# EAGLE schematic GatewayLoRa (EAGLE 9.6.2)

## Sheet 1 of 2
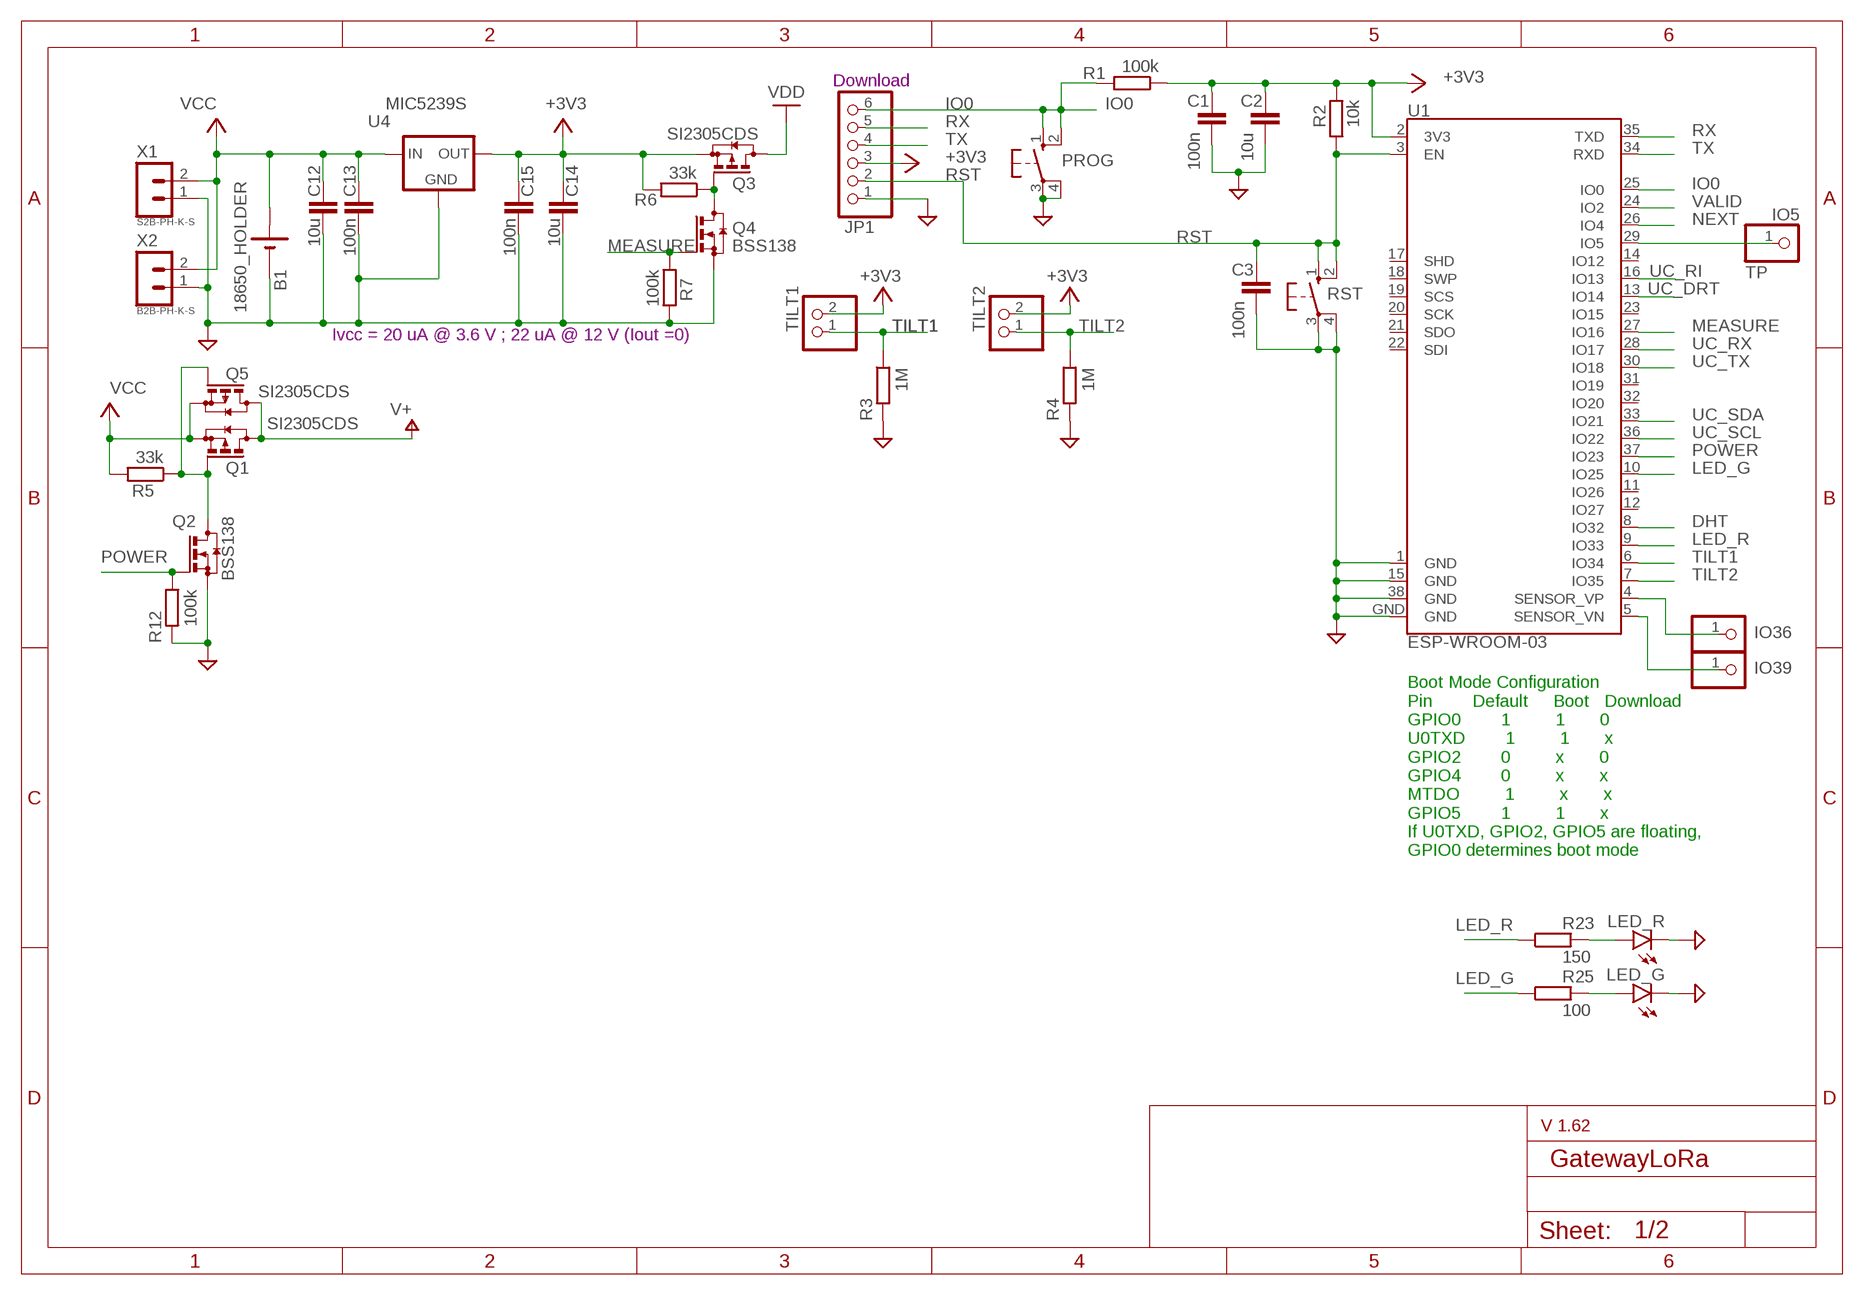
[diagram p0: schematic, sheet 1]

### Parts
B1  18650_HOLDER  [18650]
C1  100n  CC1206  [C1206]
C2  10u  CC1210  [C1210]
C3  100n  CC1206  [C1206]
C12  10u  CC1210  [C1210]
C13  100n  CC1206  [C1206]
C14  10u  CC1210  [C1210]
C15  100n  CC1206  [C1206]
IO5  TP  PINHD-1X1  [1X01]
IO36  PINHD-1X1  [1X01]
IO39  PINHD-1X1  [1X01]
JP1  PINHD-1X6  [1X06]
LED_G  LEDSMT1206  [1206]
LED_R  LEDSMT1206  [1206]
PROG  10-XX  [B3F-10XX]
Q1  SI2305CDS  [SOT23]
Q2  BSS138  BSS131  [SOT23]
Q3  SI2305CDS  [SOT23]
Q4  BSS138  BSS131  [SOT23]
Q5  SI2305CDS  [SOT23]
R1  100k  RR1206  [R1206]
R2  10k  RR1206  [R1206]
R3  1M  RR1206  [R1206]
R4  1M  RR1206  [R1206]
R5  33k  RR1206  [R1206]
R6  33k  RR1206  [R1206]
R7  100k  RR1206  [R1206]
R12  100k  RR1206  [R1206]
R23  150  RR1206  [R1206]
R25  100  RR1206  [R1206]
RST  10-XX  [B3F-10XX]
TILT1  PINHD-1X2  [1X02]
TILT2  PINHD-1X2  [1X02]
U1  ESP-WROOM-03  [ESP-WROOM-03]
U4  MIC5239S  [SOT223]
X1  S2B-PH-K-S  [S2B-PH-K-S]
X2  B2B-PH-K-S  [B2B-PH-K-S]

### Nets
+3V3: C1.1 C2.1 C14.1 C15.1 JP1.3 Q3.2(S) R1.1 R2.2 R6.2 TILT1.2 TILT2.2 U1.2(3V3) U4.3(OUT)
DHT: U1.8(IO32)
GND: B1.- C1.2 C2.2 C3.2 C12.2 C13.2 C14.2 C15.2 JP1.1 LED_G.C LED_R.C PROG.3(P) PROG.4(P1) Q2.2(S) Q4.2(S) R3.2 R4.2 R7.2 R12.2 RST.3(P) RST.4(P1) U1.1(GND) U1.15(GND) U1.38(GND) U1.GND U4.2(GND) U4.4(GND) X1.1 X2.1 ; also sheet 2
IO0: JP1.6 PROG.1(S) PROG.2(S1) R1.2 U1.25(IO0)
IO36: IO36.1 U1.4(SENSOR_VP)
IO39: IO39.1 U1.5(SENSOR_VN)
LED_G: R25.1 U1.10(IO25)
LED_R: R23.1 U1.9(IO33) ; also sheet 2
MEASURE: Q4.1(G) R7.1 U1.27(IO16)
N$1: Q1.1(G) Q2.3(D) Q5.1(G) R5.1
N$2: Q3.1(G) Q4.3(D) R6.1
N$7: LED_R.A R23.2
N$8: LED_G.A R25.2
N$17: IO5.1 U1.29(IO5)
NEXT: U1.26(IO4)
POWER: Q2.1(G) R12.1 U1.37(IO23)
RST: C3.1 JP1.2 R2.1 RST.1(S) RST.2(S1) U1.3(EN)
RX: JP1.5 U1.35(TXD)
TILT1: R3.1 TILT1.1 U1.6(IO34)
TILT2: R4.1 TILT2.1 U1.7(IO35)
TX: JP1.4 U1.34(RXD)
UC_DRT: U1.13(IO14) ; also sheet 2
UC_RI: U1.16(IO13) ; also sheet 2
UC_RX: U1.28(IO17) ; also sheet 2
UC_SCL: U1.36(IO22) ; also sheet 2
UC_SDA: U1.33(IO21) ; also sheet 2
UC_TX: U1.30(IO18) ; also sheet 2
V+: Q1.3(D) Q5.3(D)
VALID: U1.24(IO2)
VCC: B1.+ C12.1 C13.1 Q1.2(S) Q5.2(S) R5.2 U4.1(IN) X1.2 X2.2
VDD: Q3.3(D)
Unconnected: U1.11(IO26) U1.12(IO27) U1.14(IO12) U1.17(SHD) U1.18(SWP) U1.19(SCS) U1.20(SCK) U1.21(SDO) U1.22(SDI) U1.23(IO15) U1.31(IO19) U1.32(IO20)

### Notes on the sheet
- Download
- Ivcc = 20 uA @ 3.6 V ; 22 uA @ 12 V (Iout =0)
- Boot Mode Configuration
  Pin        Default     Boot   Download
  GPIO0        1         1       0
  U0TXD        1         1       x
  GPIO2        0         x       0
  GPIO4        0         x       x
  MTDO         1         x       x
  GPIO5        1         1       x
  If U0TXD, GPIO2, GPIO5 are floating, 
  GPIO0 determines boot mode
- V 1.62

## Sheet 2 of 2
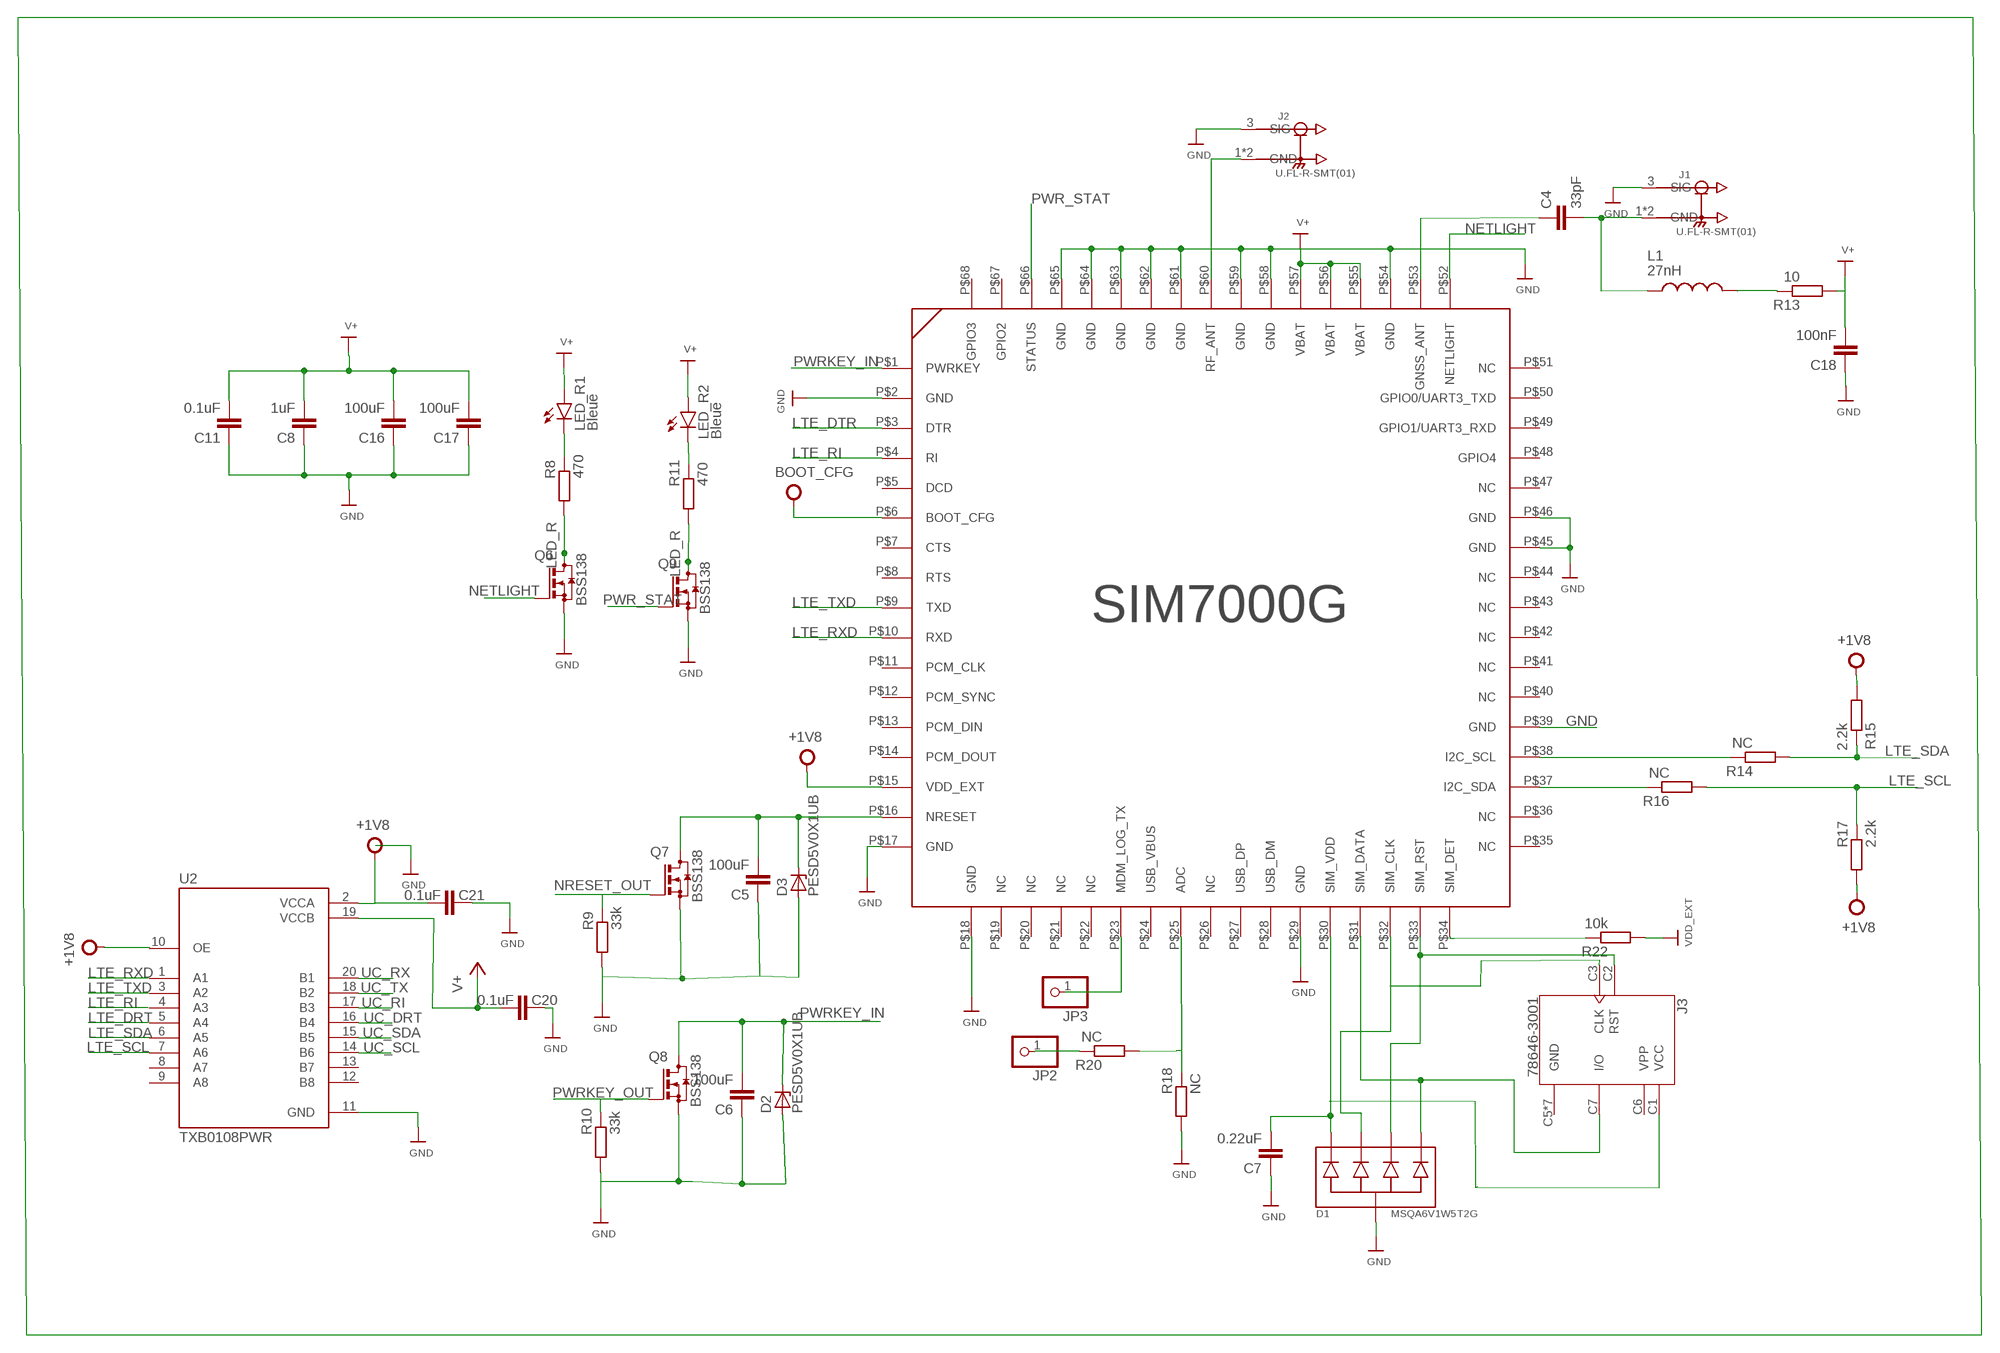
[diagram p1: schematic, sheet 2]

### Parts
C4  33pF  C-EUC0805  [C0805]
C5  100uF  C-EUC0805  [C0805]
C6  100uF  C-EUC0805  [C0805]
C7  0.22uF  C-EUC0805  [C0805]
C8  1uF  C-EUC0805  [C0805]
C11  0.1uF  C-EUC0805  [C0805]
C16  100uF  C-EUC0805  [C0805]
C17  100uF  C-EUC0805  [C0805]
C18  100nF  C-EUC0805  [C0805]
C20  0.1uF  CC1210  [C1210]
C21  0.1uF  CC1210  [C1210]
D1  MSQA6V1W5T2G  [SC88A]
D2  PESD5V0X1UB  [SOD523]
D3  PESD5V0X1UB  [SOD523]
J1  U.FL-R-SMT(01)  [HRS_U.FL-R-SMT(01)]
J2  U.FL-R-SMT(01)  [HRS_U.FL-R-SMT(01)]
J3  78646-3001  [MOLEX_78646-3001]
JP2  PINHD-1X1  [1X01]
JP3  PINHD-1X1  [1X01]
L1  27nH  LQM21PN1R0NGRD  [INDC2012X100N]
LED_R1  Bleue  LEDSMT1206  [1206]
LED_R2  Bleue  LEDSMT1206  [1206]
Q6  BSS138  BSS131  [SOT23]
Q7  BSS138  BSS131  [SOT23]
Q8  BSS138  BSS131  [SOT23]
Q9  BSS138  BSS131  [SOT23]
R8  470  RR1206  [R1206]
R9  33k  RR1206  [R1206]
R10  33k  RR1206  [R1206]
R11  470  RR1206  [R1206]
R13  10  RR1206  [R1206]
R14  NC  RR1206  [R1206]
R15  2.2k  RR1206  [R1206]
R16  NC  RR1206  [R1206]
R17  2.2k  RR1206  [R1206]
R18  NC  RR1206  [R1206]
R20  NC  RR1206  [R1206]
R22  10k  RR1206  [R1206]
U2  TXB0108PWR  [SOP65P640X120-20N]
U$1  SIM7000G  [SIM7000G]

### Nets
+1V8: C21.2 R15.1 R17.1 U2.2(VCCA) U2.10(OE) U$1.P$6(BOOT_CFG) U$1.P$15(VDD_EXT) ; supply symbol labelled BOOT_CFG
+5V: C20.2 U2.19(VCCB) ; supply symbol labelled V+
GND: C7.1 C8.1 C11.1 C16.1 C17.1 C18.1 C20.1 C21.1 D1.2 J1.3(SIG) J2.3(SIG) LED_R2.A Q6.2(S) Q9.2(S) R18.1 R22.1 U2.11(GND) U$1.P$2(GND) U$1.P$17(GND) U$1.P$18(GND) U$1.P$29(GND) U$1.P$39(GND) U$1.P$45(GND) U$1.P$46(GND) U$1.P$54(GND) U$1.P$55(VBAT) U$1.P$56(VBAT) U$1.P$57(VBAT) U$1.P$58(GND) U$1.P$59(GND) U$1.P$61(GND) U$1.P$62(GND) U$1.P$63(GND) U$1.P$64(GND) U$1.P$65(GND) ; supply symbol labelled V+, VDD_EXT ; also sheet 1
LED_R: Q6.3(D) Q9.3(D) R8.1 R11.1 ; also sheet 1
LTE_DTR: U$1.P$3(DTR)
LTE_RI: U$1.P$4(RI)
LTE_RXD: U$1.P$10(RXD)
LTE_SCL: R16.1 R17.2 U2.7(A6)
LTE_SDA: R14.1 R15.2 U2.6(A5)
LTE_TXD: U$1.P$9(TXD)
N$3: J2.1(GND) J2.2(GND) U$1.P$60(RF_ANT)
N$4: C4.2 J1.1(GND) J1.2(GND) L1.1
N$5: C4.1 U$1.P$53(GNSS_ANT)
N$6: C5.2 D3.1(K) Q7.3(D) U$1.P$16(NRESET)
N$10: LED_R1.C R8.2
N$11: J3.C1(VCC)
N$13: D1.5 J3.C7(I/O) U$1.P$31(SIM_DATA)
N$14: D1.4 J3.C2(RST) U$1.P$33(SIM_RST)
N$15: LED_R1.A
N$18: R10.2
N$19: C8.2 C11.2 C16.2 C17.2
N$22: C5.1 D3.2(A) Q7.2(S) R9.1
N$25: C6.1 D2.2(A) Q8.2(S) R10.1
N$31: D2.1(K)
N$33: LED_R2.C R11.2
N$34: R20.1
N$35: C18.2 R13.1
N$36: L1.2 R13.2
N$37: D1.3 U$1.P$32(SIM_CLK)
N$38: R14.2 U$1.P$38(I2C_SCL)
N$39: R16.2 U$1.P$37(I2C_SDA)
N$40: C7.2 D1.1 U$1.P$30(SIM_VDD)
N$41: J3.C3(CLK)
N$42: R18.2 U$1.P$25(ADC)
N$43: R22.2
N$44: U$1.P$34(SIM_DET)
N$45: JP3.1 U$1.P$23(MDM_LOG_TX)
NETLIGHT: Q6.1(G) U$1.P$52(NETLIGHT)
NRESET_OUT: Q7.1(G) R9.2
PWR_STAT: Q9.1(G) U$1.P$66(STATUS)
PWRKEY_IN: C6.2 Q8.3(D) U$1.P$1(PWRKEY)
PWRKEY_OUT: Q8.1(G)
UC_DRT: U2.16(B4) ; also sheet 1
UC_RI: U2.17(B3) ; also sheet 1
UC_RX: U2.20(B1) ; also sheet 1
UC_SCL: U2.14(B6) ; also sheet 1
UC_SDA: U2.15(B5) ; also sheet 1
UC_TX: U2.18(B2) ; also sheet 1
Unconnected: JP2.1 R20.2 U2.1(A1) U2.3(A2) U2.4(A3) U2.5(A4) U2.8(A7) U2.9(A8) U2.12(B8) U2.13(B7) U$1.P$5(DCD) U$1.P$7(CTS) U$1.P$8(RTS) U$1.P$11(PCM_CLK) U$1.P$12(PCM_SYNC) U$1.P$13(PCM_DIN) U$1.P$14(PCM_DOUT) U$1.P$19(NC) U$1.P$20(NC) U$1.P$21(NC) U$1.P$22(NC) U$1.P$24(USB_VBUS) U$1.P$26(NC) U$1.P$27(USB_DP) U$1.P$28(USB_DM) U$1.P$35(NC) U$1.P$36(NC) U$1.P$40(NC) U$1.P$41(NC) U$1.P$42(NC) U$1.P$43(NC) U$1.P$44(NC) U$1.P$47(NC) U$1.P$48(GPIO4) U$1.P$49(GPIO1/UART3_RXD) U$1.P$50(GPIO0/UART3_TXD) U$1.P$51(NC) U$1.P$67(GPIO2) U$1.P$68(GPIO3)

## Power pins joined to a net without a drawn wire
GND: J3.C5(GND) J3.G1(GND) J3.G2(GND) J3.G3(GND) J3.G4(GND) J3.G5(GND) J3.G6(GND)
VPP: J3.C6(VPP)

## Library data of the parts
B1 = battery_bms:18650_HOLDER: 18650 holder
C1-C3 C12-C15 C20 C21 = eagle-ltspice:C: CAPACITOR, European symbol; SPICEMODEL: NONE; SPICEPREFIX: C
C4-C8 C11 C16-C18 = rcl:C-EU: CAPACITOR, European symbol; SPICEPREFIX: C
D1 = MSQA6V1W5T2G:MSQA6V1W5T2G: ESD Protection Diode Array Check availability <https://pricing.snapeda.com/parts/MSQA6V1W5T2G/onsemi/view-part?ref=eda>; AVAILABILITY: In Stock; CHECK_PRICES: https://www.snapeda.com/parts/MSQA6V1W5T2G/Onsemi/view-part/?ref=eda; DESCRIPTION: Clamp Ipp Tvs Diode Surface Mount SC-88A (SC-70-5/SOT-353); MF: onsemi; MP: MSQA6V1W5T2G; PACKAGE: SC-88A-5 ON Semiconductor; PRICE: None; PURCHASE-URL: https://www.snapeda.com/api/url_track_click_mouser/?unipart_id=7122110&manufacturer=onsemi&part_name=MSQA6V1W5T2G&search_term=msqa6v1w5t2g; SNAPEDA_LINK: https://www.snapeda.com/parts/MSQA6V1W5T2G/Onsemi/view-part/?ref=snap
D2 D3 = PESD5V0X1UB:PESD5V0X1UB: Ultra low capacitance unidirectional ElectroStatic Discharge (ESD) protection diode in a SOD523 (SC-79) ultra small and flat lead Surface-Mounted Device (SMD) plastic package designed to protect one signal line from the damage caused by ESD and other transients. AAL Eindhoven MK Check availability <https://pricing.snapeda.com/parts/PESD5V0X1UB/Nexperia%20USA/view-part?ref=eda>; AVAILABILITY: In Stock; CHECK_PRICES: https://www.snapeda.com/parts/PESD5V0X1UB/Nexperia/view-part/?ref=eda; DESCRIPTION: 8V (Typ) Clamp 1.5A (8/20µs) Ipp Tvs Diode Surface Mount SOD-523; MF: Nexperia USA; MP: PESD5V0X1UB; PACKAGE: SOD-523 NXP Semiconductors; PRICE: None; SNAPEDA_LINK: https://www.snapeda.com/parts/PESD5V0X1UB/Nexperia/view-part/?ref=snap
IO5 IO36 IO39 JP2 JP3 = pinhead:PINHD-1X1: PIN HEADER
J1 J2 = U.FL-R-SMT_01_:U.FL-R-SMT(01): U.FL Series 6 Ghz 50 Ohm Ultra-small SMT Coaxial Cable Receptacle Check availability <https://pricing.snapeda.com/parts/U.FL-R-SMT%2801%29/Hirose/view-part?ref=eda>; AVAILABILITY: In Stock; CHECK_PRICES: https://www.snapeda.com/parts/U.FL-R-SMT(01)/Hirose+Electric+Co+Ltd/view-part/?ref=eda; DESCRIPTION: U.FL (UMCC) Connector Receptacle, Male Pin 50Ohm Surface Mount Solder. RF Connectors / Coaxial Connectors; MF: Hirose; MP: U.FL-R-SMT(01); PACKAGE: None; PRICE: None; PURCHASE-URL: https://www.snapeda.com/api/url_track_click_mouser/?unipart_id=49572&manufacturer=Hirose&part_name=U.FL-R-SMT(01)&search_term=None; SNAPEDA_LINK: https://www.snapeda.com/parts/U.FL-R-SMT(01)/Hirose+Electric+Co+Ltd/view-part/?ref=snap
J3 = SIM:78646-3001: Conn Micro SIM Card SKT 6 POS 2.54mm Solder RA SMD 0.5A/Contact Embossed T/R Check availability <https://pricing.snapeda.com/parts/78646-3001/Molex/view-part?ref=eda>; AVAILABILITY: In Stock; CHECK_PRICES: https://www.snapeda.com/parts/78646-3001/Molex/view-part/?ref=eda; DESCRIPTION: Horizontal Surface Mount Micro SIM Card Connector, with Push In Termination | Molex Incorporated 78646-3001; MF: Molex; MP: 78646-3001; PACKAGE: None; PRICE: None; PURCHASE-URL: https://www.snapeda.com/api/url_track_click_mouser/?unipart_id=75189&manufacturer=Molex&part_name=78646-3001&search_term=micro sim; SNAPEDA_LINK: https://www.snapeda.com/parts/78646-3001/Molex/view-part/?ref=snap
JP1 = pinhead:PINHD-1X6: PIN HEADER
L1 = LQM21PN1R0NGRD:LQM21PN1R0NGRD: LQM21PN 1uH 950mA 30% MLT; CHECK_PRICES: https://www.snapeda.com/parts/LQM21PN1R0NGRD/Murata+Electronics+North+America/view-part/?ref=eda; DESCRIPTION: Inductor with Inductance: 1uH Tol. +/-30%, Package: 0805 (2012); MF: Murata; MP: LQM21PN1R0NGRD; PACKAGE: 2012 Murata; PURCHASE-URL: https://www.snapeda.com/api/url_track_click_mouser/?unipart_id=1499484&manufacturer=Murata&part_name=LQM21PN1R0NGRD&search_term=inductance 0805; RS_COMPONENTS_1674235_PURCHASE_URL: https://www.snapeda.com/api/url_track_click/https%253A//uk.rs-online.com/web/p/surface-mount-inductors/1674235//%253Futm_campaign%253Dbuynow%2526utm_medium%253Daggregator%2526utm_source%253Dsnapeda%2526cm_mmc%253Daff-_-uk-_-snapeda-_-1674235/?unipart_id=1499484&manufacturer=Murata&part_name=LQM21PN1R0NGRD&search_term=inductance 0805; RS_COMPONENTS_7867096P_PURCHASE_URL: https://www.snapeda.com/api/url_track_click/https%253A//uk.rs-online.com/web/p/surface-mount-inductors/7867096p//%253Futm_campaign%253Dbuynow%2526utm_medium%253Daggregator%2526utm_source%253Dsnapeda%2526cm_mmc%253Daff-_-uk-_-snapeda-_-7867096P/?unipart_id=1499484&manufacturer=Murata&part_name=LQM21PN1R0NGRD&search_term=inductance 0805; RS_COMPONENTS_7867096_PURCHASE_URL: https://www.snapeda.com/api/url_track_click/https%253A//uk.rs-online.com/web/p/surface-mount-inductors/7867096//%253Futm_campaign%253Dbuynow%2526utm_medium%253Daggregator%2526utm_source%253Dsnapeda%2526cm_mmc%253Daff-_-uk-_-snapeda-_-7867096/?unipart_id=1499484&manufacturer=Murata&part_name=LQM21PN1R0NGRD&search_term=inductance 0805; SNAPEDA_LINK: https://www.snapeda.com/parts/LQM21PN1R0NGRD/Murata+Electronics+North+America/view-part/?ref=snap
LED_G LED_R LED_R1 LED_R2 = led:LED: LED OSRAM: - CHIPLED LG R971, LG N971, LY N971, LG Q971, LY Q971, LO R971, LY R971 LH N974, LH R974 LS Q976, LO Q976, LY Q976 LO Q996 - Hyper CHIPLED LW Q18S LB Q993, LB Q99A, LB R99A - SideLED LS A670, LO A670, LY A670, LG A670, LP A670 LB A673, LV A673, LT A673, LW A673 LH A674 LY A675 LS A676, LA A676, LO A676, LY A676, LW A676 LS A679, LY A679, LG A679 - Hyper Micro SIDELED® LS Y876, LA Y876, LO Y876, LY Y876 LT Y87S - SmartLED LW L88C, LW L88S LB L89C, LB L89S, LG L890 LS L89K, LO L89K, LY L89K LS L896, LA L896, LO L896, LY L896 - TOPLED LS T670, LO T670, LY T670, LG T670, LP T670 LSG T670, LSP T670, LSY T670, LOP T670, LYG T670 LG T671, LOG T671, LSG T671 LB T673, LV T673, LT T673, LW T673 LH T674 LS T676, LA T676, LO T676, LY T676, LB T676, LH T676, LSB T676, LW T676 LB T67C, LV T67C, LT T67C, LS T67K, LO T67K, LY T67K, LW E67C LS E67B, LA E67B, LO E67B, LY E67B, LB E67C, LV E67C, LT E67C LW T67C LS T679, LY T679, LG T679 LS T770, LO T770, LY T770, LG T770, LP T770 LB T773, LV T773, LT T773, LW T773 LH T774 LS E675, LA E675, LY E675, LS T675 LS T776, LA T776, LO T776, LY T776, LB T776 LHGB T686 LT T68C, LB T68C - Hyper Mini TOPLED® LB M676 - Mini TOPLED Santana® LG M470 LS M47K, LO M47K, LY M47K Source: http://www.osram.convergy.de LUXEON: - LUMILED® LXK2-PW12-R00, LXK2-PW12-S00, LXK2-PW14-U00, LXK2-PW14-V00 LXK2-PM12-R00, LXK2-PM12-S00, LXK2-PM14-U00 LXK2-PE12-Q00, LXK2-PE12-R00, LXK2-PE12-S00, LXK2-PE14-T00, LXK2-PE14-U00 LXK2-PB12-K00, LXK2-PB12-L00, LXK2-PB12-M00, LXK2-PB14-N00, LXK2-PB14-P00, LXK2-PB14-Q00 LXK2-PR12-L00, LXK2-PR12-M00, LXK2-PR14-Q00, LXK2-PR14-R00 LXK2-PD12-Q00, LXK2-PD12-R00, LXK2-PD12-S00 LXK2-PH12-R00, LXK2-PH12-S00 LXK2-PL12-P00, LXK2-PL12-Q00, LXK2-PL12-R00 Source: www.luxeon.com KINGBRIGHT: KA-3528ASYC Source: www.kingbright.com
PROG RST = switch-omron:10-XX: OMRON SWITCH; MPN: B3F-1000; OC_FARNELL: 176432; OC_NEWARK: 36M3542
Q1 Q3 Q5 = transistor-small-signal-perso:SI2305CDS: P-CHANNEL MOS FET
Q2 Q4 Q6-Q9 = transistor-small-signal-perso:BSS131: N-CHANNEL MOS FET
R1-R18 R20 R22 R23 R25 = eagle-ltspice:R: RESISTOR, European symbol; SPICEMODEL: NONE; SPICEPREFIX: R
TILT1 TILT2 = pinhead:PINHD-1X2: PIN HEADER
U1 = esp32-sparkfun (1):ESP-WROOM-03; OC_FARNELL: unknown
U2 = TXB0108PWR:TXB0108PWR: 8-Bit Bidirectional Voltage-Level Shifter with Auto Direction Sensing and +/-15-kV ESD Protect 20-TSSOP -40 to 85 Check availability <https://pricing.snapeda.com/parts/TXB0108PWR/Texas%20Instruments/view-part?ref=eda>; CHECK_PRICES: https://www.snapeda.com/parts/TXB0108PWR/Texas+Instruments/view-part/?ref=eda; DESCRIPTION: 8-Bit Bidirectional Voltage-Level Shifter with Auto Direction Sensing and +/-15-kV ESD Protect; MF: Texas Instruments; MP: TXB0108PWR; PACKAGE: TSSOP-20 Texas Instruments; PURCHASE-URL: https://www.snapeda.com/api/url_track_click_mouser/?unipart_id=45111&manufacturer=Texas Instruments&part_name=TXB0108PWR&search_term=txb0108; RS_COMPONENTS_7099038P_PURCHASE_URL: https://www.snapeda.com/api/url_track_click/https%253A//uk.rs-online.com/web/p/translator-ics/7099038p//%253Futm_campaign%253Dbuynow%2526utm_medium%253Daggregator%2526utm_source%253Dsnapeda%2526cm_mmc%253Daff-_-uk-_-snapeda-_-7099038P/?unipart_id=45111&manufacturer=Texas Instruments&part_name=TXB0108PWR&search_term=txb0108; RS_COMPONENTS_7099038_PURCHASE_URL: https://www.snapeda.com/api/url_track_click/https%253A//uk.rs-online.com/web/p/translator-ics/7099038//%253Futm_campaign%253Dbuynow%2526utm_medium%253Daggregator%2526utm_source%253Dsnapeda%2526cm_mmc%253Daff-_-uk-_-snapeda-_-7099038/?unipart_id=45111&manufacturer=Texas Instruments&part_name=TXB0108PWR&search_term=txb0108; RS_COMPONENTS_9215119_PURCHASE_URL: https://www.snapeda.com/api/url_track_click/https%253A//uk.rs-online.com/web/p/translator-ics/9215119//%253Futm_campaign%253Dbuynow%2526utm_medium%253Daggregator%2526utm_source%253Dsnapeda%2526cm_mmc%253Daff-_-uk-_-snapeda-_-9215119/?unipart_id=45111&manufacturer=Texas Instruments&part_name=TXB0108PWR&search_term=txb0108; SNAPEDA_LINK: https://www.snapeda.com/parts/TXB0108PWR/Texas+Instruments/view-part/?ref=snap
U4 = micrel:MIC5239S: LDO REGULATOR
U$1 = SIM7000G:SIM7000G; CHECK_PRICES: https://www.snapeda.com/parts/SIM7000G/SIMCom/view-part/?ref=eda; DESCRIPTION: 802.15.4 Cat-M, Cat-NB, EDGE, GPRS, LPWA Transceiver Module 850MHz, 900MHz, 1.8GHz, 1.9GHz Antenna Not Included Surface Mount; MF: SIMCom Wireless Solutions Limited; MP: SIM7000G; PACKAGE: None; PURCHASE-URL: https://www.snapeda.com/api/url_track_click_mouser/?unipart_id=12130268&manufacturer=SIMCom Wireless Solutions Limited&part_name=SIM7000G&search_term=sim7000g; SNAPEDA_LINK: https://www.snapeda.com/parts/SIM7000G/SIMCom/view-part/?ref=snap
X1 = con-JST PH:S2B-PH: JST PH series header 2.00mm pitch disconnectable crimp style connectors, horizontal (side entry type), 2 pins
X2 = con-JST PH:B2B-PH: JST PH series header 2.00mm pitch disconnectable crimp style connectors, vertical (side entry type), 2 pins